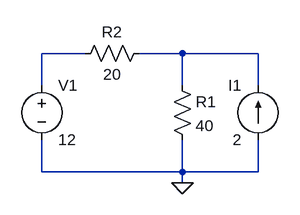
[diagram p0: schematic Q8.asc]
Q8.asc, the LTspice schematic file:
Version 4
SHEET 1 880 680
WIRE 128 0 64 0
WIRE 272 0 208 0
WIRE 384 0 272 0
WIRE 64 48 64 0
WIRE 272 48 272 0
WIRE 384 48 384 0
WIRE 64 176 64 128
WIRE 272 176 272 128
WIRE 272 176 64 176
WIRE 384 176 384 128
WIRE 384 176 272 176
WIRE 272 192 272 176
FLAG 272 192 0
SYMBOL voltage 64 32 R0
WINDOW 123 0 0 Left 0
WINDOW 39 0 0 Left 0
SYMATTR InstName V1
SYMATTR Value 12
SYMBOL res 256 32 R0
SYMATTR InstName R1
SYMATTR Value 40
SYMBOL res 224 -16 R90
WINDOW 0 0 56 VBottom 2
WINDOW 3 32 56 VTop 2
SYMATTR InstName R2
SYMATTR Value 20
SYMBOL current 384 128 R180
WINDOW 0 24 80 Left 2
WINDOW 3 24 0 Left 2
WINDOW 123 0 0 Left 0
WINDOW 39 0 0 Left 0
SYMATTR InstName I1
SYMATTR Value 2

The netlist it stands for:
* Q8.asc
V1 N001 0 12
R1 N002 0 40
R2 N002 N001 20
I1 0 N002 2
.backanno
.end